# Altium schematic sheet DcDc5V.SchDoc
size 420 x 297 mm; DocumentNumber: DcDc5V
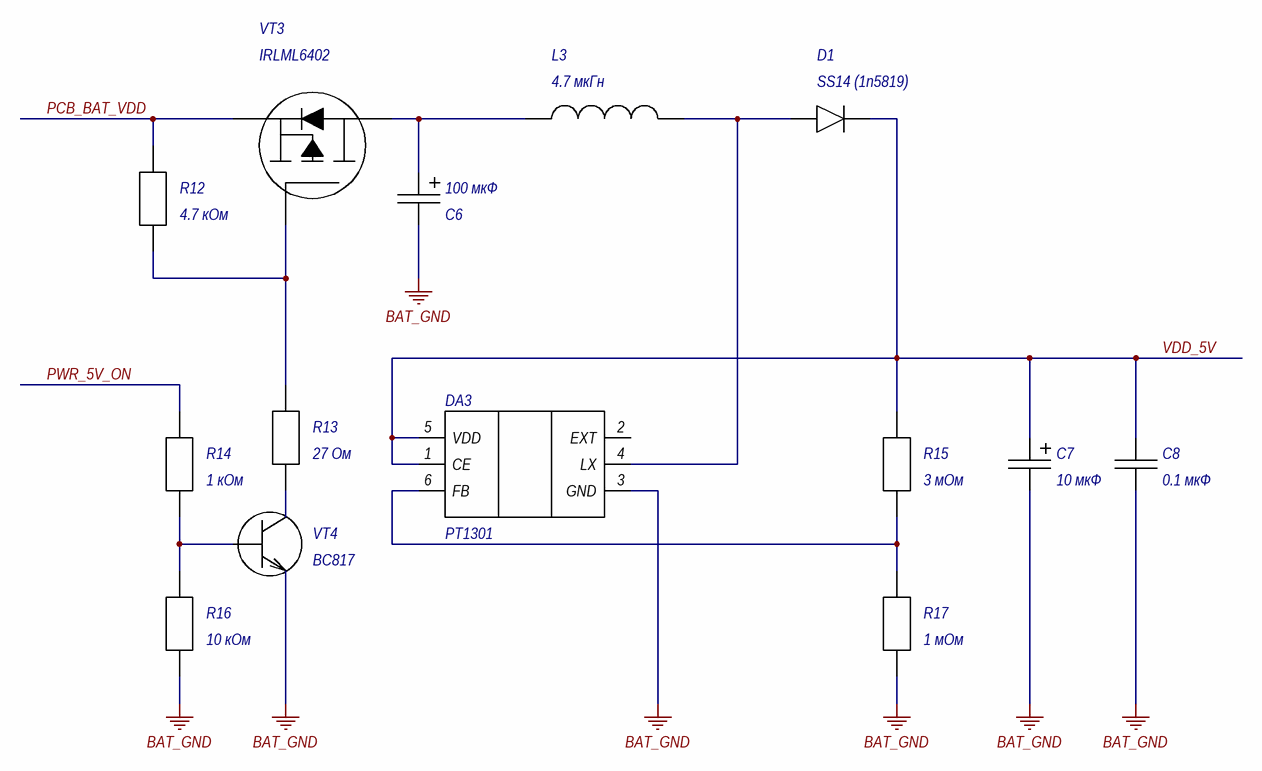
[diagram p0: DcDc5V.SchDoc]

## Parts
C6  100 мкФ  [C TAN_C]
C7  10 мкФ  [C TAN_A]
C8  0.1 мкФ  [C 0805]
D1  SS14 (1n5819)  [SMA/DO-214AC]
DA3  PT1301  [SOT-23-6]
L3  4.7 мкГн  [CD43]
R12  4.7 кОм  [RES 0402]
R13  27 Ом  [RES 0402]
R14  1 кОм  [RES 0402]
R15  3 мОм  [RES 0402]
R16  10 кОм  [RES 0402]
R17  1 мОм  [RES 0402]
VT3  IRLML6402  [SOT-23]
VT4  BC817  [SOT-23]

## Nets
BAT_GND: C6.2 C7.2 C8.2 DA3.3(GND) R16.1 R17.1 VT4.2(E)
PCB_BAT_VDD: R12.2 VT3.2(S)
PWR_5V_ON: R14.2
VDD_5V: C7.1 C8.1 D1.C DA3.1(CE) DA3.5(VDD) R15.2
NetC6_1: C6.1 L3.1 VT3.3(D)
NetD1_A: D1.A DA3.4(LX) L3.2
NetDA3_6: DA3.6(FB) R15.1 R17.2
NetR12_1: R12.1 R13.2 VT3.1(G)
NetR13_1: R13.1 VT4.3(C)
NetR14_1: R14.1 R16.2 VT4.1(B)

Not connected (* = marked no-connect by the designer): DA3 2(EXT)

## Notes on the sheet
- Подп. и дата
- Инв. № дубл.
- Взам. инв. №
- Инв. № подл.
- Лист
- Изм.
- № докум.
- Подп.
- Дата
- Копировал
- Формат А3

## Library data of the parts
C6 = CAP TAN_C: SMD Tantalium Capacitor C; Type: Конденсатор танталовый; Size: C
C7 = CAP TAN_A: SMD Tantalium Capacitor A; Type: Конденсатор танталовый; Rated voltage: 10 В; Size: A
C8 = CAP 0805: SMD Capacitor 0805; Manufacturer: /Укажите компанию-производителя/; Tolerance: /Укажите допуск в процентах/; Temperature coefficient: /Формат: ±? ppm/°C/; Type: Конденсатор керамический; TC: /Укажите тип диэлектрика/; Size: 0805; Temperature range: /Формат: -? ... ? °C/
D1 = D SS14 (1n5819)
DA3 = PT1301: DC-DC step-up (повышающий) PT1301 в корпусе SOT23-6.
L3 = L 4.7 uH: Катушка индуктивности 4.7 мкГн корпус CD43 (индуктивность 4.7 uH).
R12-R17 = RES 0402
VT4 = BC817: NPN general-purpose transistor; Manufacturer: NXP; Structure: n-p-n; Type: Транзистор биполярный; hFE: 160 ... 600; Max collector-emitter voltage: 45 В; Max collector-base voltage: 50 В; Max emitter-base voltage: 5 В; Max collector current: 0,5 А; Max collector peak current: 1 А; Power dissitipation: 0,25 Вт; fT: 100 МГц; Collector-emitter saturation voltage: 0,7 В; Base-emitter on voltage: 1,2 В; Specitication: ЭКБ ИП; Collector-base сapacitance: 3 пФ; Complement: BC807; Temperature range: -65 ... 150 °C